# EAGLE design schematic (EAGLE 9.6.1)
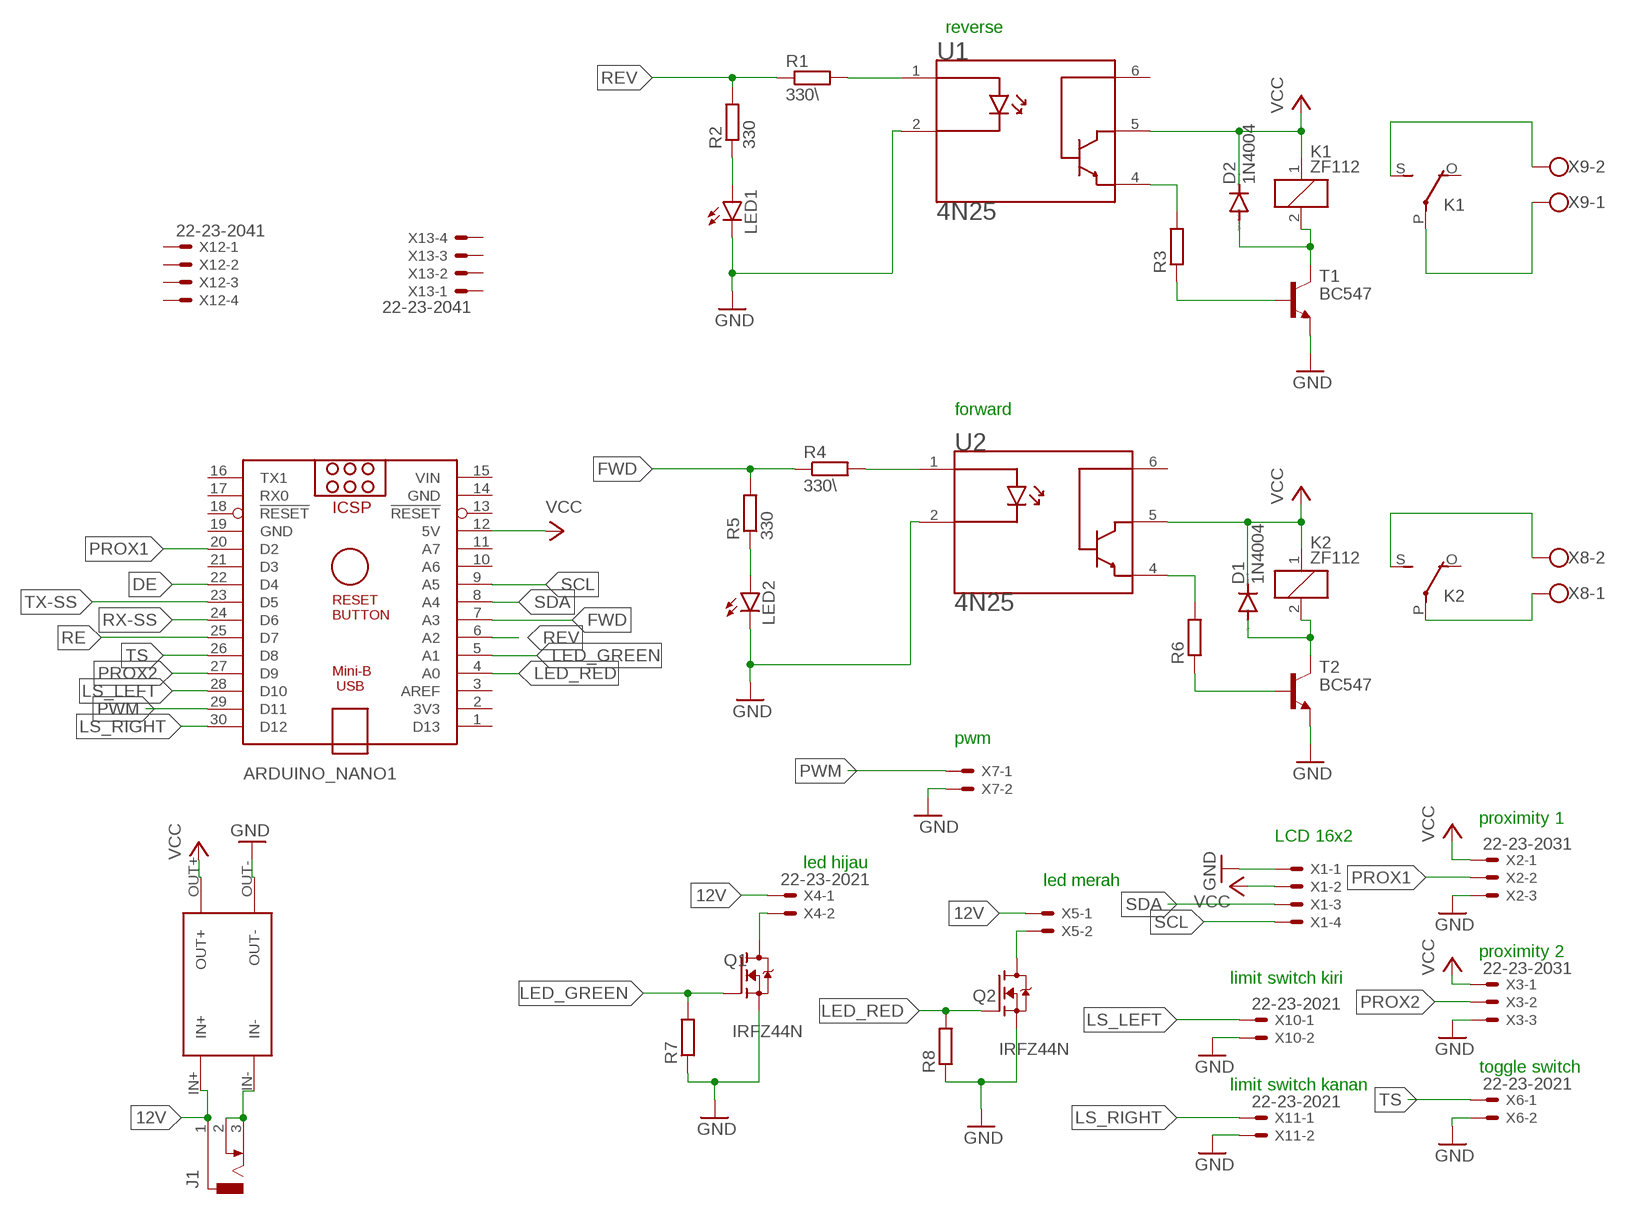
[diagram p0: schematic, sheet 1]

## Parts
ARDUINO_NANO1  ARDUINO_NANO  [ARDUINO_NANO]
D1  1N4004  [DO41-10]
D2  1N4004  [DO41-10]
J1  DCJ0303  [DCJ0303]
K1  ZF112  [ZF112]
K2  ZF112  [ZF112]
LED1  LED5MM  [LED5MM]
LED2  LED5MM  [LED5MM]
Q1  IRFZ44N  [TO254P1016X419X2286-3]
Q2  IRFZ44N  [TO254P1016X419X2286-3]
R1  330\  R-EU_0207/10  [0207/10]
R2  330  R-EU_0207/10  [0207/10]
R3  R-EU_0207/10  [0207/10]
R4  330\  R-EU_0207/10  [0207/10]
R5  330  R-EU_0207/10  [0207/10]
R6  R-EU_0207/10  [0207/10]
R7  R-EU_0207/10  [0207/10]
R8  R-EU_0207/10  [0207/10]
T1  BC547  [TO92]
T2  BC547  [TO92]
U1  4N25  [DIP762W50P254L712H400Q6N]
U2  4N25  [DIP762W50P254L712H400Q6N]
U$1  XL4005  [XL4005]
X1  22-23-2041  [22-23-2041]
X2  22-23-2031  [22-23-2031]
X3  22-23-2031  [22-23-2031]
X4  22-23-2021  [22-23-2021]
X5  22-23-2021  [22-23-2021]
X6  22-23-2021  [22-23-2021]
X7  22-23-2021  [22-23-2021]
X8  W237-102  [W237-102]
X9  W237-102  [W237-102]
X10  22-23-2021  [22-23-2021]
X11  22-23-2021  [22-23-2021]
X12  22-23-2041  [22-23-2041]
X13  22-23-2041  [22-23-2041]

## Nets
12V: J1.1 U$1.IN+ X4.1 X5.1
DE: ARDUINO_NANO1.22(D4)
FWD: ARDUINO_NANO1.7(A3) R4.1 R5.2
GND: LED1.K(C) LED2.K(C) Q1.3(S) Q2.3(S) R7.1 R8.1 T1.1(E) T2.1(E) U1.2(K) U2.2(K) U$1.OUT- X1.1 X2.3 X3.3 X6.2 X7.2 X10.2 X11.2
LED_GREEN: ARDUINO_NANO1.5(A1) Q1.1(G) R7.2
LED_RED: ARDUINO_NANO1.4(A0) Q2.1(G) R8.2
LS_LEFT: ARDUINO_NANO1.28(D10) X10.1
LS_RIGHT: ARDUINO_NANO1.30(D12) X11.1
N$1: R1.2 U1.1(A)
N$3: LED1.A R2.1
N$5: R3.2 U1.4(E)
N$6: R3.1 T1.2(B)
N$7: D2.A K1.2 T1.3(C)
N$8: R4.2 U2.1(A)
N$10: LED2.A R5.1
N$12: R6.2 U2.4(E)
N$13: R6.1 T2.2(B)
N$14: D1.A K2.2 T2.3(C)
N$17: Q1.2(D) X4.2
N$18: Q2.2(D) X5.2
N$19: K1.P(2:P) X9.1
N$20: K1.S(2:S) X9.2
N$21: K2.S(2:S) X8.2
N$22: K2.P(2:P) X8.1
N$27: J1.2 J1.3 U$1.IN-
PROX1: ARDUINO_NANO1.20(D2) X2.2
PROX2: ARDUINO_NANO1.27(D9) X3.2
PWM: ARDUINO_NANO1.29(D11) X7.1
RE: ARDUINO_NANO1.25(D7)
REV: ARDUINO_NANO1.6(A2) R1.1 R2.2
RX-SS: ARDUINO_NANO1.24(D6)
SCL: ARDUINO_NANO1.9(A5) X1.4
SDA: ARDUINO_NANO1.8(A4) X1.3
TS: ARDUINO_NANO1.26(D8) X6.1
TX-SS: ARDUINO_NANO1.23(D5)
VCC: ARDUINO_NANO1.12(5V) D1.C D2.C K1.1 K2.1 U1.5(C) U2.5(C) U$1.OUT+ X1.2 X2.1 X3.1
Unconnected: ARDUINO_NANO1.1(D13) ARDUINO_NANO1.2(3V3) ARDUINO_NANO1.3(AREF) ARDUINO_NANO1.10(A6) ARDUINO_NANO1.11(A7) ARDUINO_NANO1.13(!RESET) ARDUINO_NANO1.16(TX1) ARDUINO_NANO1.17(RX0) ARDUINO_NANO1.18(!RESET) ARDUINO_NANO1.21(D3) K1.O(2:O) K2.O(2:O) U1.6(B) U2.6(B) X12.1 X12.2 X12.3 X12.4 X13.1 X13.2 X13.3 X13.4

## Notes on the sheet
- reverse
- forward
- pwm
- proximity 1
- LCD 16x2
- led hijau
- led merah
- proximity 2
- limit switch kiri
- toggle switch
- limit switch kanan

## Power pins joined to a net without a drawn wire
GND: ARDUINO_NANO1.14(GND) ARDUINO_NANO1.19(GND)
VIN: ARDUINO_NANO1.15(VIN)

## Library data of the parts
ARDUINO_NANO1 = ArduinoNanoV30:ARDUINO_NANO: Arduino Nano V3.0 Overview: The Arduino Nano is a small, complete, and breadboard-friendly board based on the ATmega328 (Arduino Nano 3.x) or ATmega168 (Arduino Nano 2.x). It has more or less the same functionality of the Arduino Duemilanove, but in a different package. It lacks only a DC power jack, and works with a Mini-B USB cable instead of a standard one. The Nano was designed and is being produced by Gravitech. Specifications: Microcontroller Atmel ATmega168 or ATmega328 Operating Voltage (logic level) 5 V Input Voltage (recommended) 7-12 V Input Voltage (limits) 6-20 V Digital I/O Pins 14 (of which 6 provide PWM output) Analog Input Pins 8 DC Current per I/O Pin 40 mA Flash Memory 16 KB (ATmega168) or 32 KB (ATmega328) of which 2 KB used by bootloader SRAM 1 KB (ATmega168) or 2 KB (ATmega328) EEPROM 512 bytes (ATmega168) or 1 KB (ATmega328) Clock Speed 16 MHz Dimensions 0.73" x 1.70" Length 45 mm Width 18 mm Weigth 5 g Power: The Arduino Nano can be powered via the Mini-B USB connection, 6-20V unregulated external power supply (pin 30), or 5V regulated external power supply (pin 27). The power source is automatically selected to the highest voltage source. Memory: The ATmega168 has 16 KB of flash memory for storing code (of which 2 KB is used for the bootloader); the ATmega328 has 32 KB, (also with 2 KB used for the bootloader). The ATmega168 has 1 KB of SRAM and 512 bytes of EEPROM (which can be read and written with the EEPROM library); the ATmega328 has 2 KB of SRAM and 1 KB of EEPROM. Input and Output: Each of the 14 digital pins on the Nano can be used as an input or output, using pinMode(), digitalWrite(), and digitalRead() functions. They operate at 5 volts. Each pin can provide or receive a maximum of 40 mA and has an internal pull-up resistor (disconnected by default) of 20-50 kOhms. In addition, some pins have specialized functions. Visit Arduino - ArduinoBoardNano <https://www.arduino.cc/en/Main/ArduinoBoardNano>
D1 D2 = diode:1N4004: DIODE general purpose rectifier, 1 A
J1 = con-jack:DCJ0303: DC POWER JACK Source: DCJ0303.pdf; OC_FARNELL: unknown; OC_NEWARK: unknown
K1 K2 = relay:ZF112: RELAY 1 x switch; OC_FARNELL: unknown; OC_NEWARK: unknown
LED1 LED2 = led:LED: LED OSRAM: - CHIPLED LG R971, LG N971, LY N971, LG Q971, LY Q971, LO R971, LY R971 LH N974, LH R974 LS Q976, LO Q976, LY Q976 LO Q996 - Hyper CHIPLED LW Q18S LB Q993, LB Q99A, LB R99A - SideLED LS A670, LO A670, LY A670, LG A670, LP A670 LB A673, LV A673, LT A673, LW A673 LH A674 LY A675 LS A676, LA A676, LO A676, LY A676, LW A676 LS A679, LY A679, LG A679 - Hyper Micro SIDELED® LS Y876, LA Y876, LO Y876, LY Y876 LT Y87S - SmartLED LW L88C, LW L88S LB L89C, LB L89S, LG L890 LS L89K, LO L89K, LY L89K LS L896, LA L896, LO L896, LY L896 - TOPLED LS T670, LO T670, LY T670, LG T670, LP T670 LSG T670, LSP T670, LSY T670, LOP T670, LYG T670 LG T671, LOG T671, LSG T671 LB T673, LV T673, LT T673, LW T673 LH T674 LS T676, LA T676, LO T676, LY T676, LB T676, LH T676, LSB T676, LW T676 LB T67C, LV T67C, LT T67C, LS T67K, LO T67K, LY T67K, LW E67C LS E67B, LA E67B, LO E67B, LY E67B, LB E67C, LV E67C, LT E67C LW T67C LS T679, LY T679, LG T679 LS T770, LO T770, LY T770, LG T770, LP T770 LB T773, LV T773, LT T773, LW T773 LH T774 LS E675, LA E675, LY E675, LS T675 LS T776, LA T776, LO T776, LY T776, LB T776 LHGB T686 LT T68C, LB T68C - Hyper Mini TOPLED® LB M676 - Mini TOPLED Santana® LG M470 LS M47K, LO M47K, LY M47K Source: http://www.osram.convergy.de LUXEON: - LUMILED® LXK2-PW12-R00, LXK2-PW12-S00, LXK2-PW14-U00, LXK2-PW14-V00 LXK2-PM12-R00, LXK2-PM12-S00, LXK2-PM14-U00 LXK2-PE12-Q00, LXK2-PE12-R00, LXK2-PE12-S00, LXK2-PE14-T00, LXK2-PE14-U00 LXK2-PB12-K00, LXK2-PB12-L00, LXK2-PB12-M00, LXK2-PB14-N00, LXK2-PB14-P00, LXK2-PB14-Q00 LXK2-PR12-L00, LXK2-PR12-M00, LXK2-PR14-Q00, LXK2-PR14-R00 LXK2-PD12-Q00, LXK2-PD12-R00, LXK2-PD12-S00 LXK2-PH12-R00, LXK2-PH12-S00 LXK2-PL12-P00, LXK2-PL12-Q00, LXK2-PL12-R00 Source: www.luxeon.com KINGBRIGHT: KA-3528ASYC Source: www.kingbright.com
Q1 Q2 = IRFZ44N:IRFZ44N: Check availability <https://pricing.snapeda.com/parts/IRFZ44N/Infineon%20Technologies/view-part?ref=eda>; AVAILABILITY: Not in stock; DESCRIPTION: N-Channel 55 V 49A (Tc) 94W (Tc) Through Hole TO-220AB; MF: Infineon Technologies; MP: IRFZ44N; PACKAGE: TO-220-3 Infineon; PRICE: None
R1-R8 = rcl:R-EU_: RESISTOR, European symbol; SPICEPREFIX: R
T1 T2 = transistor:BC547: NPN TRANSISTOR
U1 U2 = 4N25:4N25: Optoisolator, Transistor Output Check availability <https://pricing.snapeda.com/parts/4N25/Vishay%20Semiconductor%20Opto%20Division/view-part?ref=eda>; AVAILABILITY: In Stock; DESCRIPTION: Optocoupler DC-IN 1-CH Transistor With Base DC-OUT 6-Pin PDIP Tube; MF: Vishay Semiconductor Opto Division; MP: 4N25; PACKAGE: None; PRICE: None; PURCHASE-URL: https://pricing.snapeda.com/search/part/4N25/?ref=eda
U$1 = xl4005:XL4005
X1 X12 X13 = con-molex:22-23-2041: .100" (2.54mm) Center Header - 4 Pin; MF: MOLEX; MPN: 22-23-2041; OC_FARNELL: 1462920; OC_NEWARK: 38C0355
X2 X3 = con-molex:22-23-2031: .100" (2.54mm) Center Header - 3 Pin; MF: MOLEX; MPN: 22-23-2031; OC_FARNELL: 1462950; OC_NEWARK: 30C0862
X4-X7 X10 X11 = con-molex:22-23-2021: .100" (2.54mm) Center Header - 2 Pin; MF: MOLEX; MPN: 22-23-2021; OC_FARNELL: 1462926; OC_NEWARK: 25C3832
X8 X9 = con-wago-500:W237-102: WAGO SCREW CLAMP; MPN: 237-102; OC_FARNELL: unknown; OC_NEWARK: 70K9898

## Board
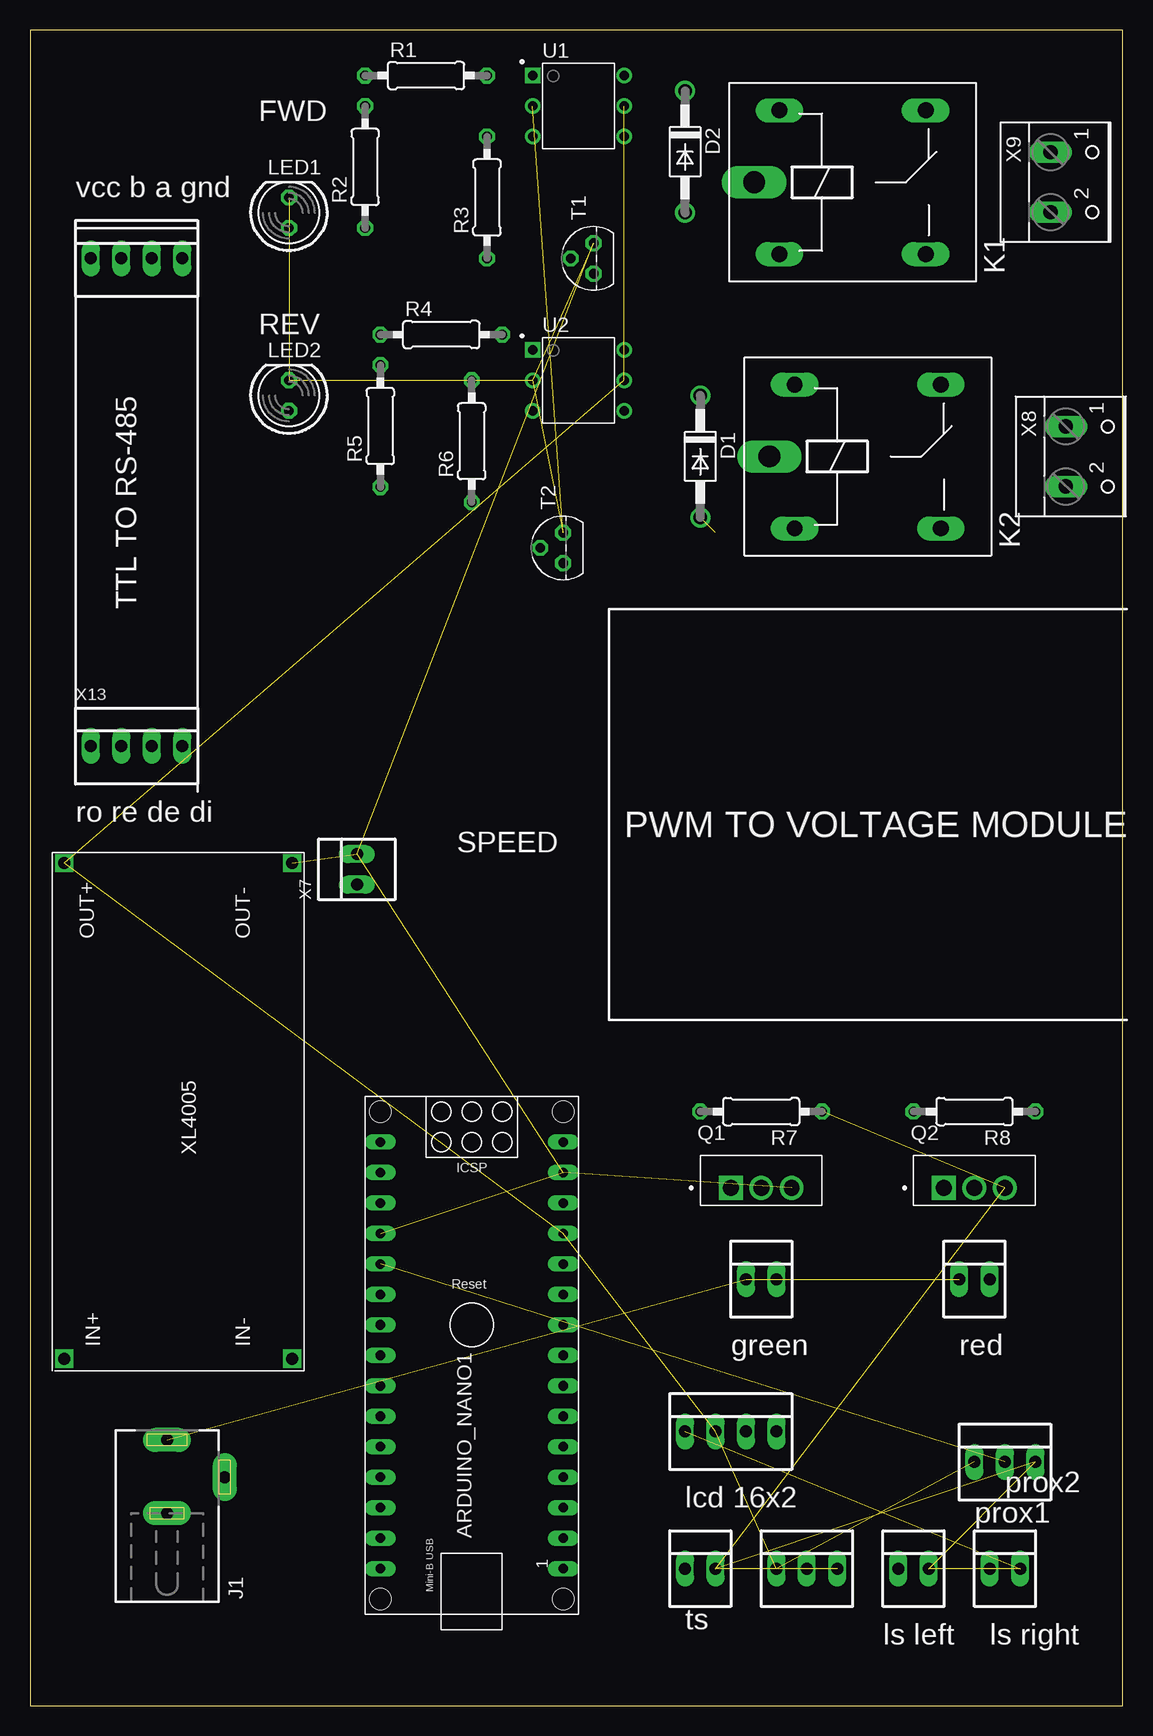
[diagram p1: board, top side]
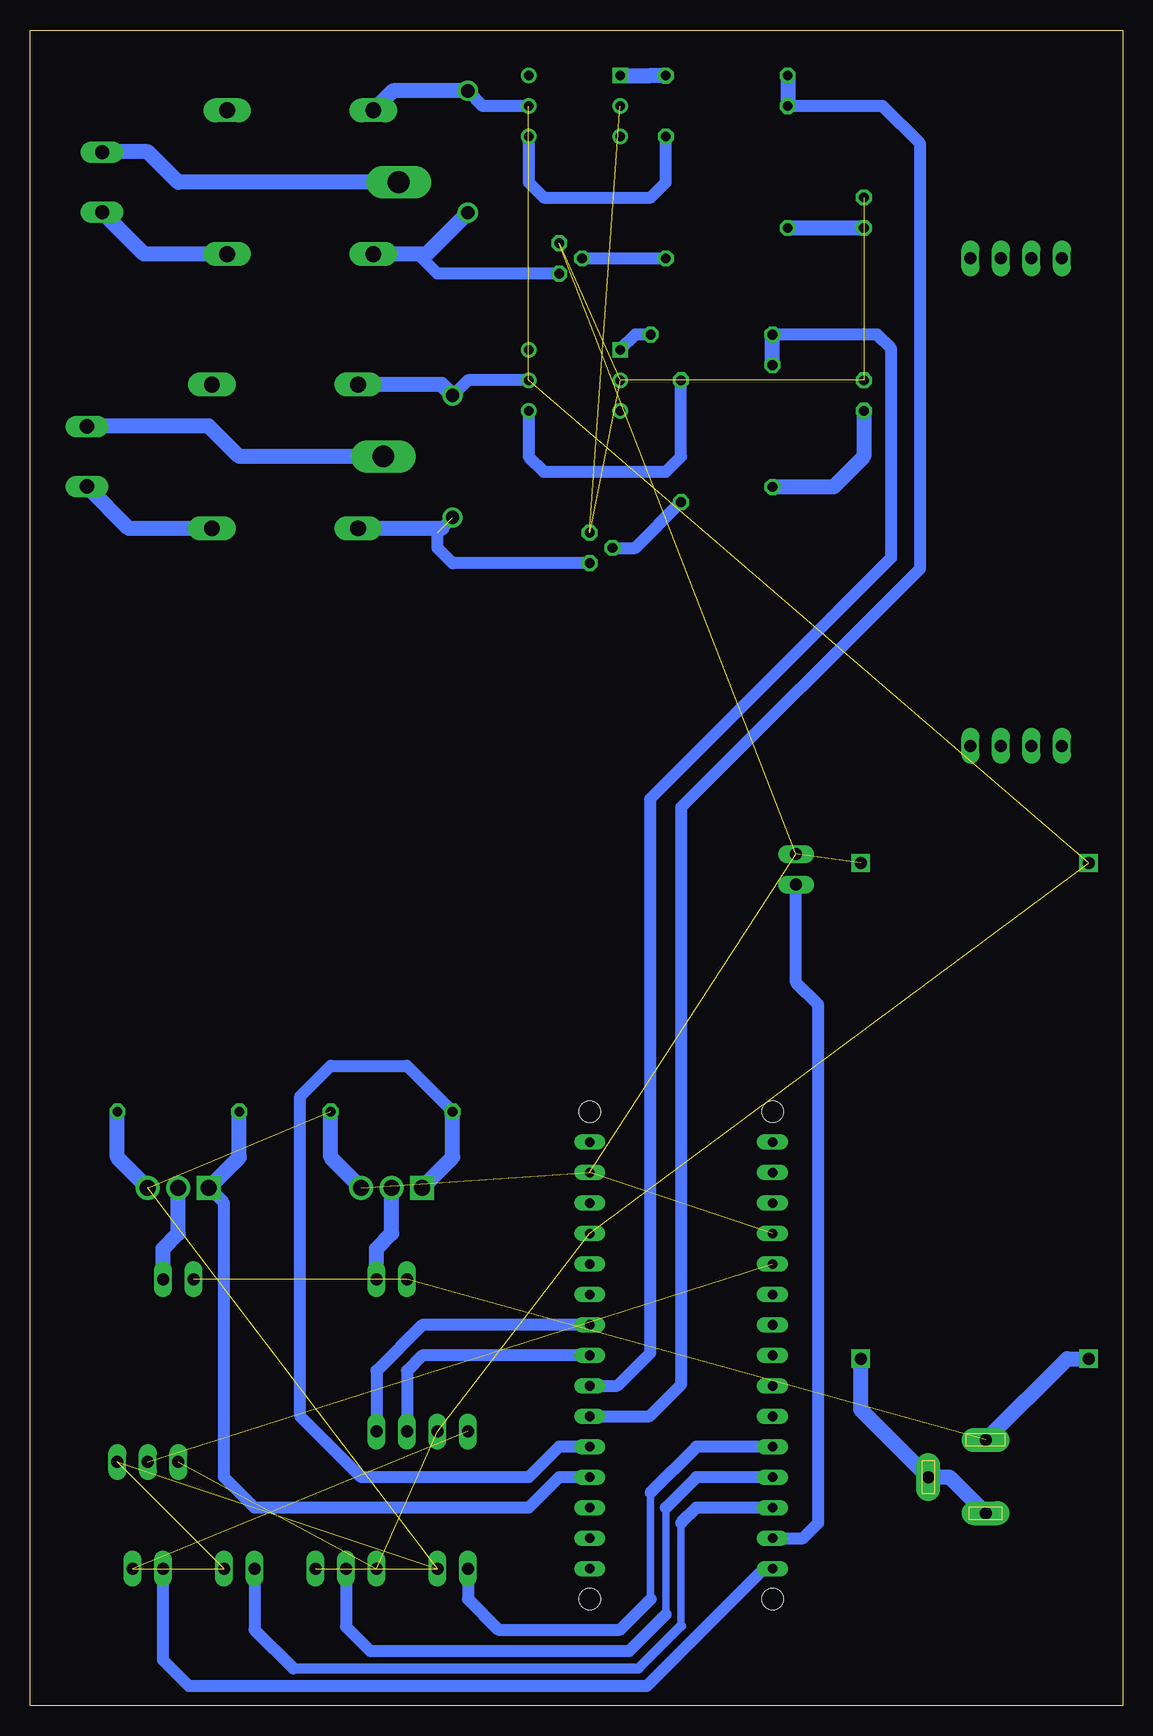
[diagram p2: board, bottom side, seen from below]

Size 91.11 x 139.69 mm. Coordinates in mm from the lower left corner, seen from the top.
Outline: 0,0 91.11,0 91.11,139.69 0,139.69 0,0
Copper layers (1*16): Top 0.035mm / dielectric 1.5mm / Bottom 0.035mm
Design rules "default": minimum track width 6mil, minimum drill 0.35mm, track to track 6mil, track to pad 6mil, pad to pad 6mil, via to via 6mil, smd to smd 6mil, copper to edge 40mil, drill to drill 6mil, minimum pad ring 10mil, minimum via ring 8mil, stop-mask expansion 4mil, vias tented up to drill 0mil, thermal gap 10mil

### Footprints (pad centres in the part's own frame; a part is rotated, then mirrored left to right if it is on the bottom)
ARDUINO_NANO = drill 0.8 long: 1 -20.32,-7.62; 2 -17.78,-7.62; 3 -15.24,-7.62; 4 -12.7,-7.62; 5 -10.16,-7.62; 6 -7.62,-7.62; 7 -5.08,-7.62; 8 -2.54,-7.62; 9 0,-7.62; 10 2.54,-7.62; 11 5.08,-7.62; 12 7.62,-7.62; 13 10.16,-7.62; 14 12.7,-7.62; 15 15.24,-7.62; 16 15.24,7.62; 17 12.7,7.62; 18 10.16,7.62; 19 7.62,7.62; 20 5.08,7.62; 21 2.54,7.62; 22 0,7.62; 23 -2.54,7.62; 24 -5.08,7.62; 25 -7.62,7.62; 26 -10.16,7.62; 27 -12.7,7.62; 28 -15.24,7.62; 29 -17.78,7.62; 30 -20.32,7.62 | hole 1.778: -22.86,-7.62; -22.86,7.62; 17.78,7.62; 17.78,-7.62
DO41-10 = drill 1.118: A 5.08,0; C -5.08,0
DCJ0303 = drill 1 pad 2 long: 1 0,3.1; 2 4.8,0; 3 0,-3
ZF112 = drill 1.321 long: 1 -6.096,5.994; 2 -6.096,-5.994; O 6.096,5.994; S 6.096,-5.994 | drill 1.803 long: P -8.204,0
LED5MM = drill 0.813 octagon: A -1.27,0; K 1.27,0
TO254P1016X419X2286-3 = drill 1.33 square: 1 -2.54,0 | drill 1.33: 2 0,0; 3 2.54,0
0207/10 = drill 0.813 octagon: 1 -5.08,0; 2 5.08,0
TO92 = drill 0.813 octagon: 1 1.27,0; 2 0,1.905; 3 -1.27,0
DIP762W50P254L712H400Q6N = drill 0.8 square: 1 -3.81,2.54 | drill 0.8: 2 -3.81,0; 3 -3.81,-2.54; 4 3.81,-2.54; 5 3.81,0; 6 3.81,2.54
XL4005 = drill 1 square: IN+ 1,20; IN- 1,1; OUT+ 42.3,20; OUT- 42.3,1
22-23-2041 = drill 1 long: 1 -3.81,0; 2 -1.27,0; 3 1.27,0; 4 3.81,0
22-23-2031 = drill 1 long: 1 -2.54,0; 2 0,0; 3 2.54,0
22-23-2021 = drill 1 long: 1 -1.27,0; 2 1.27,0
W237-102 = drill 1.194 long: 1 -2.5,-1.27; 2 2.5,-1.27

### Placement (x,y rotation side)
ARDUINO_NANO1  36.83,31.75 90 top
D1  55.88,104.14 270 top
D2  54.61,129.54 270 top
J1  11.43,19.05 0 top
K1  68.58,127 0 top
K2  69.85,104.14 0 top
LED1  21.59,124.46 90 top
LED2  21.59,109.22 90 top
Q1  60.96,43.18 0 top
Q2  78.74,43.18 0 top
R1  33.02,135.89 0 top
R2  27.94,128.27 90 top
R3  38.1,125.73 90 top
R4  34.29,114.3 0 top
R5  29.21,106.68 90 top
R6  36.83,105.41 90 top
R7  60.96,49.53 180 top
R8  78.74,49.53 180 top
T1  46.99,120.65 90 top
T2  44.45,96.52 90 top
U1  45.72,133.35 0 top
U2  45.72,110.49 0 top
U$1  22.86,27.94 90 top
X1  58.42,22.86 0 top
X2  81.28,20.32 0 top
X3  64.77,11.43 0 top
X4  60.96,35.56 0 top
X5  78.74,35.56 0 top
X6  55.88,11.43 0 top
X7  27.25,69.73 90 top
X8  87.63,104.14 270 top
X9  86.36,127 270 top
X10  73.66,11.43 0 top
X11  81.28,11.43 0 top
X12  8.89,120.65 0 top
X13  8.89,80.01 0 top

### Tracks (layer width: path | path; a pad name or v marks a point on that pad's centre or on a via)
12V  (2 unrouted)
  Bottom 1.27: J1.1 4.64,28.94 U$1.IN+
FWD
  Bottom 1.016: ARDUINO_NANO1.7 42.14,26.67 39.4,29.41 39.4,75.61 19.3,95.71 19.3,113.11 20.49,114.3 R4.1
  Bottom 1.27: R5.2 R4.1
GND  (17 unrouted)
  Bottom 1.27: Q1.3 66.04,45.72 R7.1 | Q2.3 83.82,45.72 R8.1
LED_GREEN
  Bottom 1.016: ARDUINO_NANO1.5 46.99,21.59 49.53,19.05 63.5,19.05 68.58,24.13 68.58,50.8 66.04,53.34 59.69,53.34 R7.2
  Bottom 1.27: Q1.1 55.88,45.72 R7.2
LED_RED
  Bottom 1.016: ARDUINO_NANO1.4 46.99,19.05 49.53,16.51 72.39,16.51 74.93,19.05 74.93,41.91 Q2.1
  Bottom 1.27: Q2.1 73.66,45.72 R8.2
LS_LEFT
  Bottom 0.61: 36.83,15.24 36.83,6.65
  Bottom 0.813: 36.83,6.65 40.37,3.11 69.15,3.11
  Bottom 1.016: ARDUINO_NANO1.28 35.56,16.51 36.83,15.24 | X10.1 72.39,6.35 69.15,3.11
LS_RIGHT
  Bottom 1.016: ARDUINO_NANO1.30 29.91,11.43 39.7,1.64 77.84,1.64 80.01,3.81 X11.1
N$1
  Bottom 1.27: R1.2 39.37,135.89 U1.1
N$3
  Bottom 1.27: LED1.A R2.1
N$5
  Bottom 1.016: U1.4 49.53,127 48.26,125.73 39.37,125.73 38.1,127 R3.2
N$6
  Bottom 1.016: T1.2 R3.1
N$7
  Bottom 1.016: T1.3 57.15,119.38 58.42,120.65 58.42,121.01
  Bottom 1.27: D2.A 58.06,121.01 58.42,121.01 K1.2
N$8
  Bottom 1.016: R4.2 40.64,114.3 U2.1
N$10
  Bottom 1.27: LED2.A 21.59,104.14 24.13,101.6 R5.1
N$12
  Bottom 1.016: U2.4 49.53,104.14 48.26,102.87 38.1,102.87 36.83,104.14 R6.2
N$13
  Bottom 1.016: T2.2 40.64,96.52 R6.1
N$14  (1 unrouted)
  Bottom 1.016: T2.3 55.88,95.25 57.15,96.52 57.15,97.79 | D1.A 56.79,98.15
  Bottom 1.27: 56.79,98.15 K2.2
N$17
  Bottom 1.27: X4.2 62.23,38.1 60.96,39.37 Q1.2
N$18
  Bottom 1.27: X5.2 80.01,38.1 78.74,39.37 Q2.2
N$19
  Bottom 1.27: K1.P 78.74,127 81.28,129.54 85.05,129.54 X9.1
N$20
  Bottom 1.27: K1.S 81.6,121.01 X9.2
N$21
  Bottom 1.27: K2.S 82.87,98.15 X8.2
N$22
  Bottom 1.27: K2.P 73.66,104.14 76.2,106.68 86.32,106.68 X8.1
N$27
  Bottom 1.27: J1.3 14.43,19.05 J1.2 21.86,24.68 U$1.IN-
PROX1  (1 unrouted)
PROX2
  Bottom 0.61: 38.1,7.62 38.1,16.51
  Bottom 1.016: ARDUINO_NANO1.27 35.56,19.05 38.1,16.51 | X3.2 64.77,6.6 62.75,4.58 41.14,4.58 38.1,7.62
PWM
  Bottom 1.016: ARDUINO_NANO1.29 26.67,13.97 25.4,15.24 25.4,58.42 27.25,60.27 X7.1
REV
  Bottom 1.016: ARDUINO_NANO1.6 39.48,24.13 36.8,26.81 36.8,74.91 16.9,94.81 16.9,130.21 20.04,133.35 R2.2
  Bottom 1.27: R1.1 R2.2
SCL
  Bottom 1.016: ARDUINO_NANO1.9 58.42,31.75 62.23,27.94 X1.4
SDA
  Bottom 1.016: ARDUINO_NANO1.8 58.42,29.21 59.69,27.94 X1.3
TS
  Bottom 0.61: 39.37,8.89 39.37,17.78
  Bottom 1.016: ARDUINO_NANO1.26 35.56,21.59 39.37,17.78 | X6.1 54.61,8.89 52.07,6.35 41.91,6.35 39.37,8.89
VCC  (6 unrouted)
  Bottom 1.016: U1.5 53.34,133.35 D2.C | U2.5 54.61,110.49 D1.C
  Bottom 1.27: D2.C 60.86,134.62 K1.1 | D1.C 56.79,110.13 K2.1

### Text on the board
tPlace: PWM TO VOLTAGE MODULE
tNames: FWD | vcc b a gnd | REV | TTL TO RS-485 | ro re de di | SPEED | green | red | prox2 | lcd 16x2 | prox1 | ts | ls left | ls right